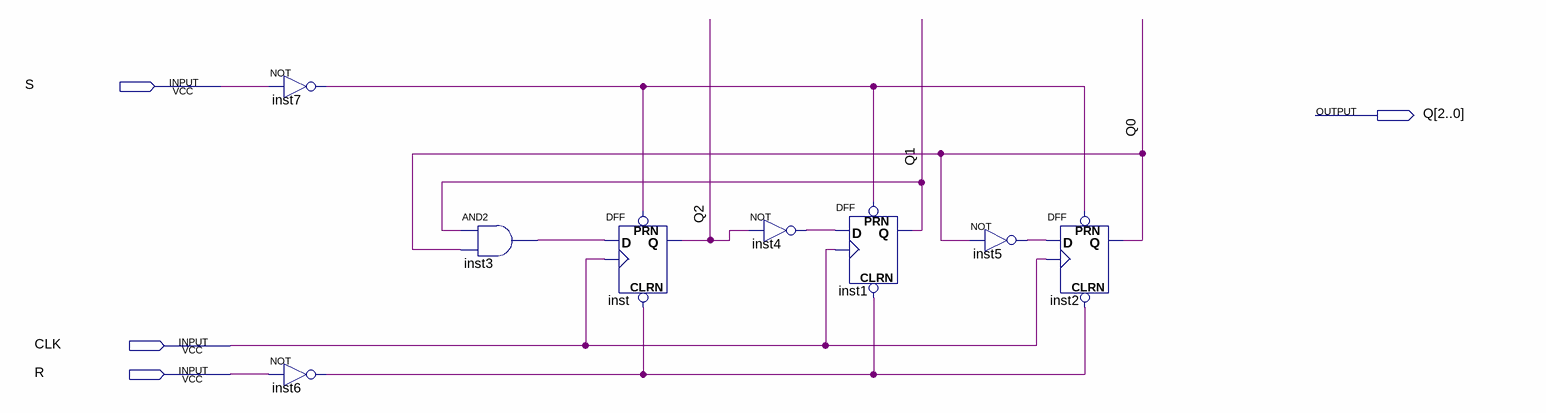
[diagram p0: schematic sheet]
// Quartus schematic contmisterioso.bdf as structural Verilog: 8 symbols, 4 pins
module contmisterioso (
  input  S,
  input  CLK,
  input  R,
  output [2:0] Q
);

  wire inst3_out, inst4_out, inst5_out, inst6_out, inst7_out;

  not inst7 (inst7_out, S);
  not inst6 (inst6_out, R);
  and inst3 (inst3_out, Q[1], Q[0]);
  DFF inst (.CLRN(inst6_out), .CLK(CLK), .D(inst3_out), .PRN(inst7_out), .Q(Q[2]));
  not inst4 (inst4_out, Q[2]);
  DFF inst1 (.CLRN(inst6_out), .CLK(CLK), .D(inst4_out), .PRN(inst7_out), .Q(Q[1]));
  not inst5 (inst5_out, Q[0]);
  DFF inst2 (.CLRN(inst6_out), .CLK(CLK), .D(inst5_out), .PRN(inst7_out), .Q(Q[0]));
endmodule
